# EAGLE design ltc2943_breakout (EAGLE 6.5.0)
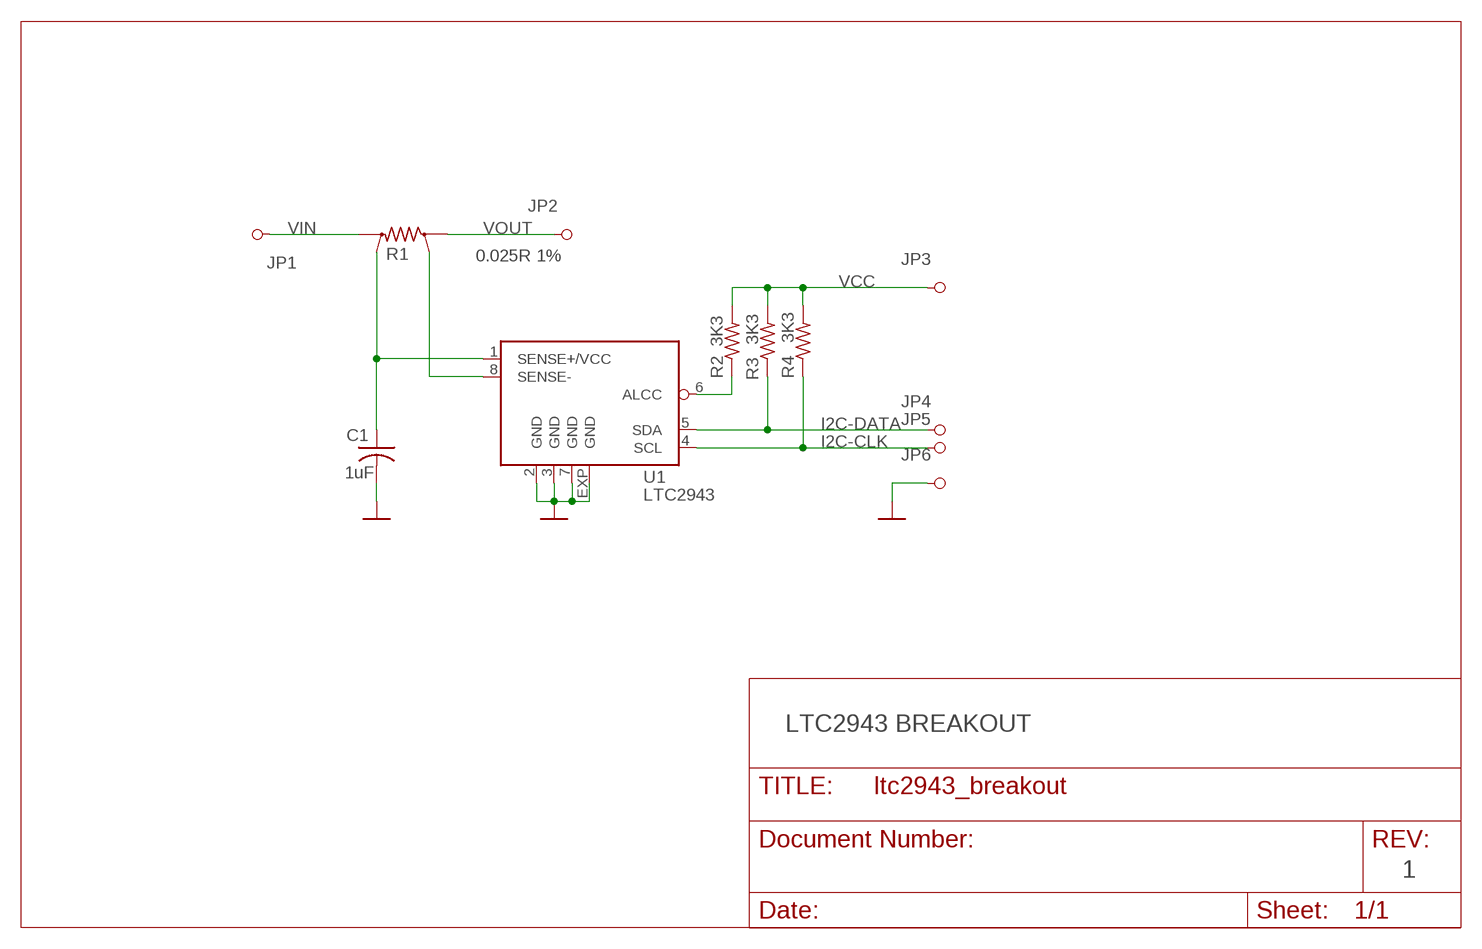
[diagram p0: schematic, sheet 1]

## Parts
C1  1uF  CAP-C0603  [C0603]
JP1  PINHD-1X1  [1X01]
JP2  PINHD-1X1  [1X01]
JP3  PINHD-1X1  [1X01]
JP4  PINHD-1X1  [1X01]
JP5  PINHD-1X1  [1X01]
JP6  PINHD-1X1  [1X01]
R1  0.025R 1%  RES-SHUNT-6432  [KELVIN-6432]
R2  3K3  RES-R0603  [R0603]
R3  3K3  RES-R0603  [R0603]
R4  3K3  RES-R0603  [R0603]
U1  LTC2943  [DFN8-3X3]

## Nets
GND: C1.2 JP6.1 U1.2(GND) U1.3(GND) U1.7(GND) U1.EXP(GND)
I2C-CLK: JP5.1 R4.1 U1.4(SCL)
I2C-DATA: JP4.1 R3.1 U1.5(SDA)
N$1: R2.1 U1.6(ALCC)
N$2: R1.V1 U1.8(SENSE-)
SENSE+: C1.1 R1.V2 U1.1(SENSE+/VCC)
VCC: JP3.1 R2.2 R3.2 R4.2
VIN: JP1.1 R1.I2
VOUT: JP2.1 R1.I1

## Notes on the sheet
- LTC2943 BREAKOUT
- 1

## Library data of the parts
C1 = ltc2943_breakout:CAP-: CAPACITOR, American symbol
JP1-JP6 = ltc2943_breakout:PINHD-1X1: PIN HEADER
R1 = ltc2943_breakout:RES-SHUNT-: SMD SHUNT RESISTOR
R2-R4 = ltc2943_breakout:RES-: RESISTOR, American symbol
U1 = ltc2943_breakout:LTC2943

## Net classes
1 power: width 0.254 mm

## Board
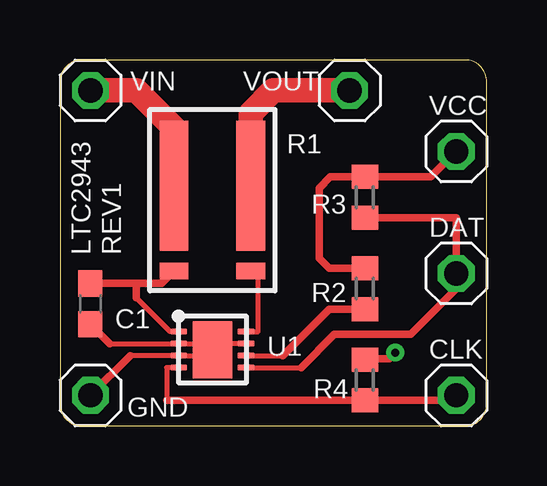
[diagram p1: board, top side]
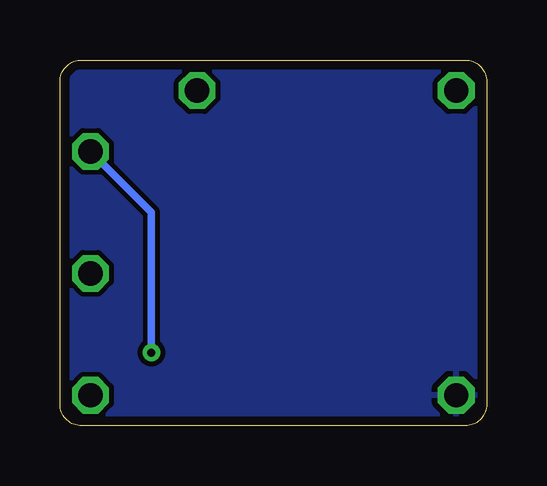
[diagram p2: board, bottom side, seen from below]

Size 17.78 x 15.24 mm. Coordinates in mm from the lower left corner, seen from the top.
Outline: 0,14.34 0,0.9 arc90 0.9,0 16.88,0 arc90 17.78,0.9 17.78,14.34 arc90 16.88,15.24 0.9,15.24 arc90 0,14.34
Copper layers (1*16): Top 0.035mm / dielectric 1.5mm / Bottom 0.035mm
Design rules "default *": minimum track width 8mil, minimum drill 13mil, track to track 8mil, track to pad 8mil, pad to pad 8mil, via to via 8mil, smd to smd 8mil, copper to edge 15mil, drill to drill 8mil, minimum pad ring 10mil, minimum via ring 8mil, stop-mask expansion 4mil, vias tented up to drill 20mil, thermal gap 10mil

### Footprints (pad centres in the part's own frame; a part is rotated, then mirrored left to right if it is on the bottom)
C0603 = smd 1.1 x 1: 1 -0.85,0; 2 0.85,0
1X01 = drill 1.016 octagon: 1 0,0
KELVIN-6432 = smd 1.2 x 5.4: I1 -1.6,2.7; I2 1.6,2.7 | smd 1.2 x 0.7: V1 -1.6,6.25; V2 1.6,6.25
R0603 = smd 1 x 1.1: 1 -0.85,0; 2 0.85,0
DFN8-3X3 = smd 0.25 x 0.7: 1 -0.75,-1.4; 2 -0.25,-1.4; 3 0.25,-1.4; 4 0.75,-1.4; 5 0.75,1.4; 6 0.25,1.4; 7 -0.25,1.4; 8 -0.75,1.4 | smd 2.38 x 1.65: EXP 0,0

### Placement (x,y rotation side)
C1  1.27,5.08 270 top
JP1  1.27,13.97 0 top
JP2  12.07,13.97 0 top
JP3  16.51,11.43 0 top
JP4  16.51,6.35 0 top
JP5  16.51,1.27 0 top
JP6  1.27,1.27 0 top
R1  6.35,12.7 180 top
R2  12.7,5.71 90 top
R3  12.7,9.53 90 top
R4  12.7,1.9 90 top
U1  6.35,3.18 270 top

### Tracks (layer width: path | path; a pad name or v marks a point on that pad's centre or on a via)
GND
  Top 0.203: 2.08,3.43 U1.2 6.1,3.43 U1.EXP | 2.93,2.93 U1.3 6.1,2.93 U1.EXP | U1.7 6.6,3.43 U1.EXP
  Top 0.305: C1.2 2.08,3.43 | 2.93,2.93 JP6.1
  pour Bottom: 0,15.24 17.78,15.24 17.78,0 0,0
I2C-CLK
  Top 0.203: 16.51,1.06 JP5.1 | U1.4 4.45,2.42 4.45,1.06
  Top 0.305: 16.51,1.06 R4.1 4.45,1.06
I2C-DATA
  Top 0.203: U1.5 10.04,2.42
  Top 0.305: R3.1 16.51,8.68 JP4.1 16.51,5.71 14.61,3.81 11.43,3.81 10.04,2.42
N$1
  Top 0.203: U1.6 9.28,2.93
  Top 0.305: 9.28,2.93 11.21,4.87 R2.1
N$2
  Top 0.203: U1.8 8.26,3.93 8.26,6.45 R1.V1
SENSE+
  Top 0.203: U1.1 4.58,3.93 3.18,5.33
  Top 0.305: R1.V2 4.23,5.93 3.18,5.93 | 3.18,5.93 C1.1 | 3.18,5.33 3.18,5.93
VCC  (via drill 0.33)
  Top 0.203: 12.7,2.79 R4.2
  Top 0.305: JP3.1 15.46,10.38 R3.2 11.26,10.38 10.79,9.91 10.79,6.99 11.21,6.56 R2.2 | 12.7,2.79 13.72,2.79 v13.97,3.05
  Bottom 0.305: v13.97,3.05 13.97,8.89 JP3.1
VIN
  Top 0.813: 4.75,12.39 R1.I2
  Top 1.016: JP1.1 3.18,13.97 4.75,12.39
VOUT
  Top 1.016: JP2.1 8.89,13.97 7.95,13.03 R1.I1

### Text on the board
tPlace: VIN | VOUT | VCC | DAT | LTC2943 | REV1 | CLK | GND